# EAGLE design ChargeControllerMainBoard-v2 (EAGLE 9.2.2)
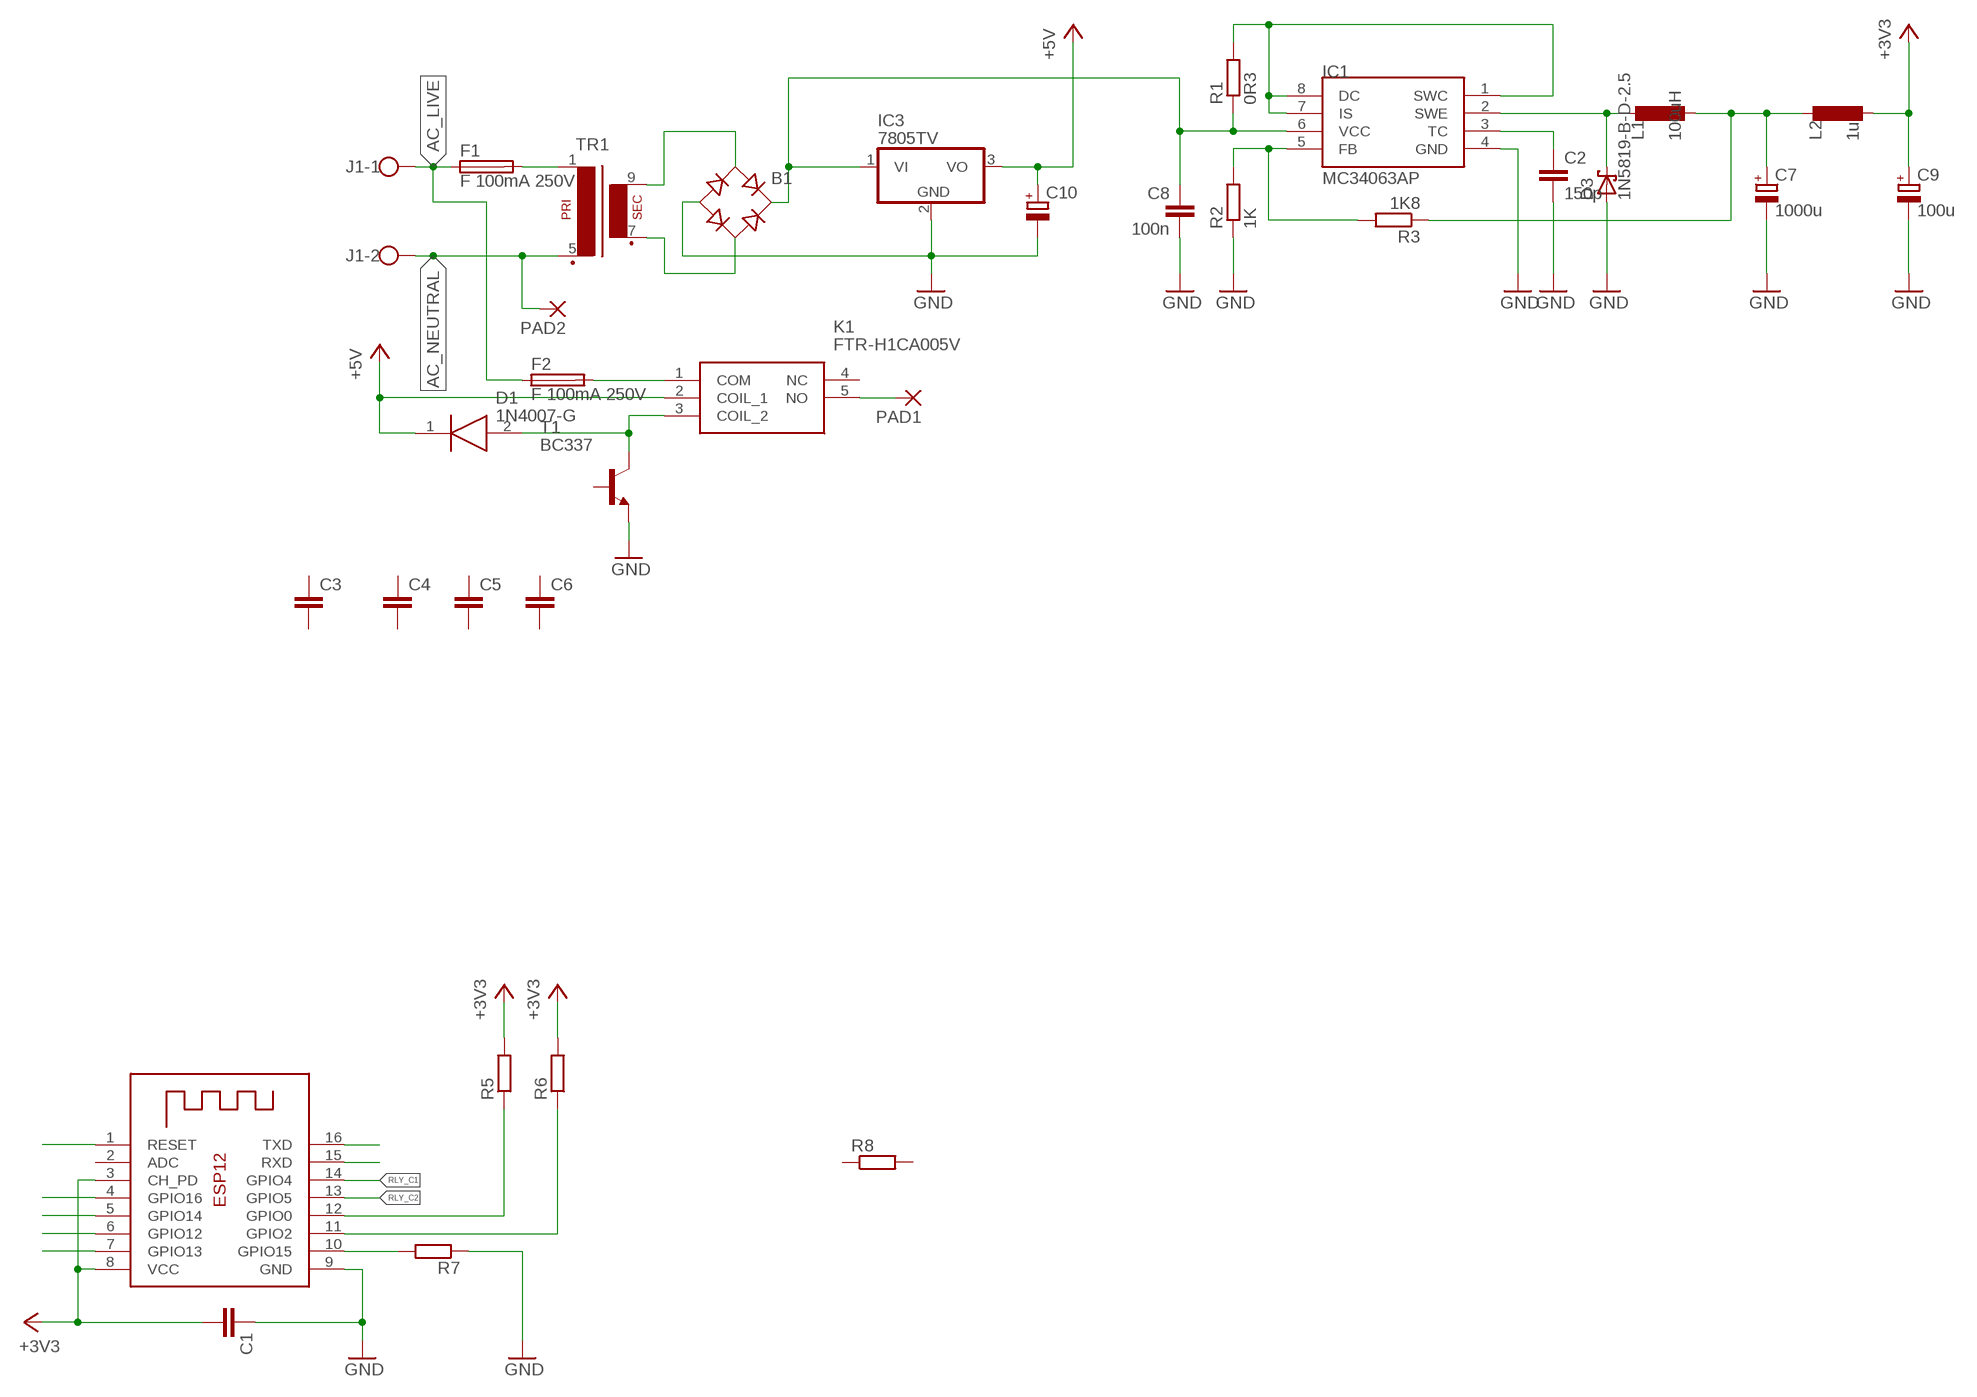
[diagram p0: schematic, sheet 1]

## Parts
B1  B-DIL  [B-DIL]
C1  C-EUC0805  [C0805]
C2  150p  C-EU025-024X044  [C025-024X044]
C3  C-EUC0805  [C0805]
C4  C-EUC0805  [C0805]
C5  C-EUC0805  [C0805]
C6  C-EUC0805  [C0805]
C7  1000u  CPOL-EUE3.5-8  [E3,5-8]
C8  100n  C-EU025-024X044  [C025-024X044]
C9  100u  CPOL-EUE3.5-8  [E3,5-8]
C10  CPOL-EUE3.5-8  [E3,5-8]
D1  1N4007-G  [DIOAD1410W90L470D235]
D3  1N5819-B-D-2.5  [D-2.5]
F1  F 100mA 250V  SH22,5  [SH22,5]
F2  F 100mA 250V  SH22,5  [SH22,5]
IC1  MC34063AP  [DIL08]
IC3  7805TV  [TO220V]
J1  W237-102  [W237-102]
K1  FTR-H1CA005V  [FTRH1CA005V]
L1  100uH  L-EU6000-XXX-RC  [6000-XXXX-RC]
L2  1u  L-EU0204V  [0204V]
PAD1  2,54/1,1  [2,54/1,1]
PAD2  2,54/1,1  [2,54/1,1]
R1  0R3  R-EU_0204/2V  [0204V]
R2  1K  R-EU_0204/2V  [0204V]
R3  1K8  R-EU_0204/2V  [0204V]
R5  R-EU_R0805  [R0805]
R6  R-EU_R0805  [R0805]
R7  R-EU_R0805  [R0805]
R8  R-EU_R0805  [R0805]
T1  BC337  [TO92]
TR1  EI30-1  [EI30-1]
X1  ESP-12  [ESP-12]

## Nets
+3V3: C1.2 C9.+ L2.2 R5.2 R6.2 X1.3(CH_PD) X1.8(VCC)
+5V: C10.+ D1.1(K) IC3.3(VO) K1.2(COIL_1)
AC_LIVE: F1.1 F2.1 J1.1
AC_NEUTRAL: J1.2 PAD2.1(P) TR1.5(P2)
GND: B1.- C1.1 C2.2 C7.- C8.2 C9.- C10.- D3.A IC1.4(GND) IC3.2(GND) R2.1 R7.1 T1.1(E) X1.9(GND)
N$1: IC1.1(SWC) IC1.7(IS) IC1.8(DC) R1.2
N$2: IC1.5(FB) R2.2 R3.2
N$3: C2.1 IC1.3(TC)
N$4: D3.C IC1.2(SWE) L1.1
N$5: B1.AC1 TR1.9(S4)
N$6: C7.+ L1.2 L2.1 R3.1
N$7: K1.5(NO) PAD1.1(P)
N$8: F2.2 K1.1(COM)
N$9: B1.AC2 TR1.7(S3)
N$10: D1.2(A) K1.3(COIL_2) T1.3(C)
N$11: R5.1 X1.12(GPIO0)
N$12: R6.1 X1.11(GPIO2)
N$13: R7.2 X1.10(GPIO15)
N$14: X1.7(GPIO13)
N$15: X1.6(GPIO12)
N$16: X1.5(GPIO14)
N$17: X1.4(GPIO16)
N$18: X1.1(RESET)
N$20: F1.2 TR1.1
N$21: X1.15(RXD)
N$22: X1.16(TXD)
N$25: B1.+ C8.1 IC1.6(VCC) IC3.1(VI) R1.1
RLY_C1: X1.14(GPIO4)
RLY_C2: X1.13(GPIO5)
Unconnected: C3.1 C3.2 C4.1 C4.2 C5.1 C5.2 C6.1 C6.2 K1.4(NC) R8.1 R8.2 T1.2(B) X1.2(ADC)

## Library data of the parts
B1 = rectifier:B-DIL: RECTIFIER
C1-C6 C8 = rcl:C-EU: CAPACITOR, European symbol; SPICEPREFIX: C
C7 C9 C10 = rcl:CPOL-EU: POLARIZED CAPACITOR, European symbol; SPICEPREFIX: C
D1 = SamacSys_Parts:1N4007-G: Rectifiers 1A 1000V Source: Datasheet <http://www.comchiptech.com/cms/UserFiles/QW-BG013 1N4001 Thru456224. 1N4007 REV.A.pdf>; ALLIED_NUMBER: 70426645; ALLIED_PRICE-STOCK: https://www.alliedelec.com/comchip-technology-1n4007-g/70426645/; DESCRIPTION: Rectifiers 1A 1000V; HEIGHT: mm; MANUFACTURER_NAME: Comchip Technology; MANUFACTURER_PART_NUMBER: 1N4007-G; MOUSER_PART_NUMBER: 750-1N4007-G; MOUSER_PRICE-STOCK: https://www.mouser.com/Search/Refine.aspx?Keyword=750-1N4007-G
D3 = _mod_diode:1N581*: 1.0A SCHOTTKY BARRIER RECTIFIER Source: http://www.diodes.com/datasheets/ds23001.pdf
F1 F2 = fuse:SH22,5: FUSE HOLDER grid 22,5 mm, OGN0031 8201, Schurter (Buerklin); MF: SCHURTER; MPN: 0031.8201; OC_FARNELL: 1162740; OC_NEWARK: 96F8317
IC1 = mc34063:MC34063
IC3 = linear:78*: Positive VOLTAGE REGULATOR Source: http://cache.national.com/ds/LM/LM78L05.pdf http://www.fairchildsemi.com/ds/LM/LM7805.pdf
J1 = con-wago-500:W237-102: WAGO SCREW CLAMP; MPN: 237-102; OC_FARNELL: unknown; OC_NEWARK: 70K9898
K1 = SamacSys_Parts:FTR-H1CA005V: General Purpose Relays Low Profile 10A 5VDC Source: Datasheet <https://www.fujitsu.com/downloads/MICRO/fcai/relays/ftr-h1.pdf>; DESCRIPTION: General Purpose Relays Low Profile 10A 5VDC; HEIGHT: 16mm; MANUFACTURER_NAME: FUJITSU; MANUFACTURER_PART_NUMBER: FTR-H1CA005V; MOUSER_PART_NUMBER: 817-FTR-H1CA005V; MOUSER_PRICE-STOCK: https://www.mouser.com/Search/Refine.aspx?Keyword=817-FTR-H1CA005V
L1 L2 = rcl:L-EU: INDUCTOR, European symbol; SPICEPREFIX: L
PAD1 PAD2 = wirepad:2,54/1,1: THROUGH-HOLE PAD
R1-R3 R5-R8 = rcl:R-EU_: RESISTOR, European symbol; SPICEPREFIX: R
T1 = transistor:BC337: NPN TRANSISTOR
TR1 = trafo:EI30-1: TRANSFORMER 1 primary winding, 1 secondary winding ERA
X1 = adafruit:ESP-12

## Board
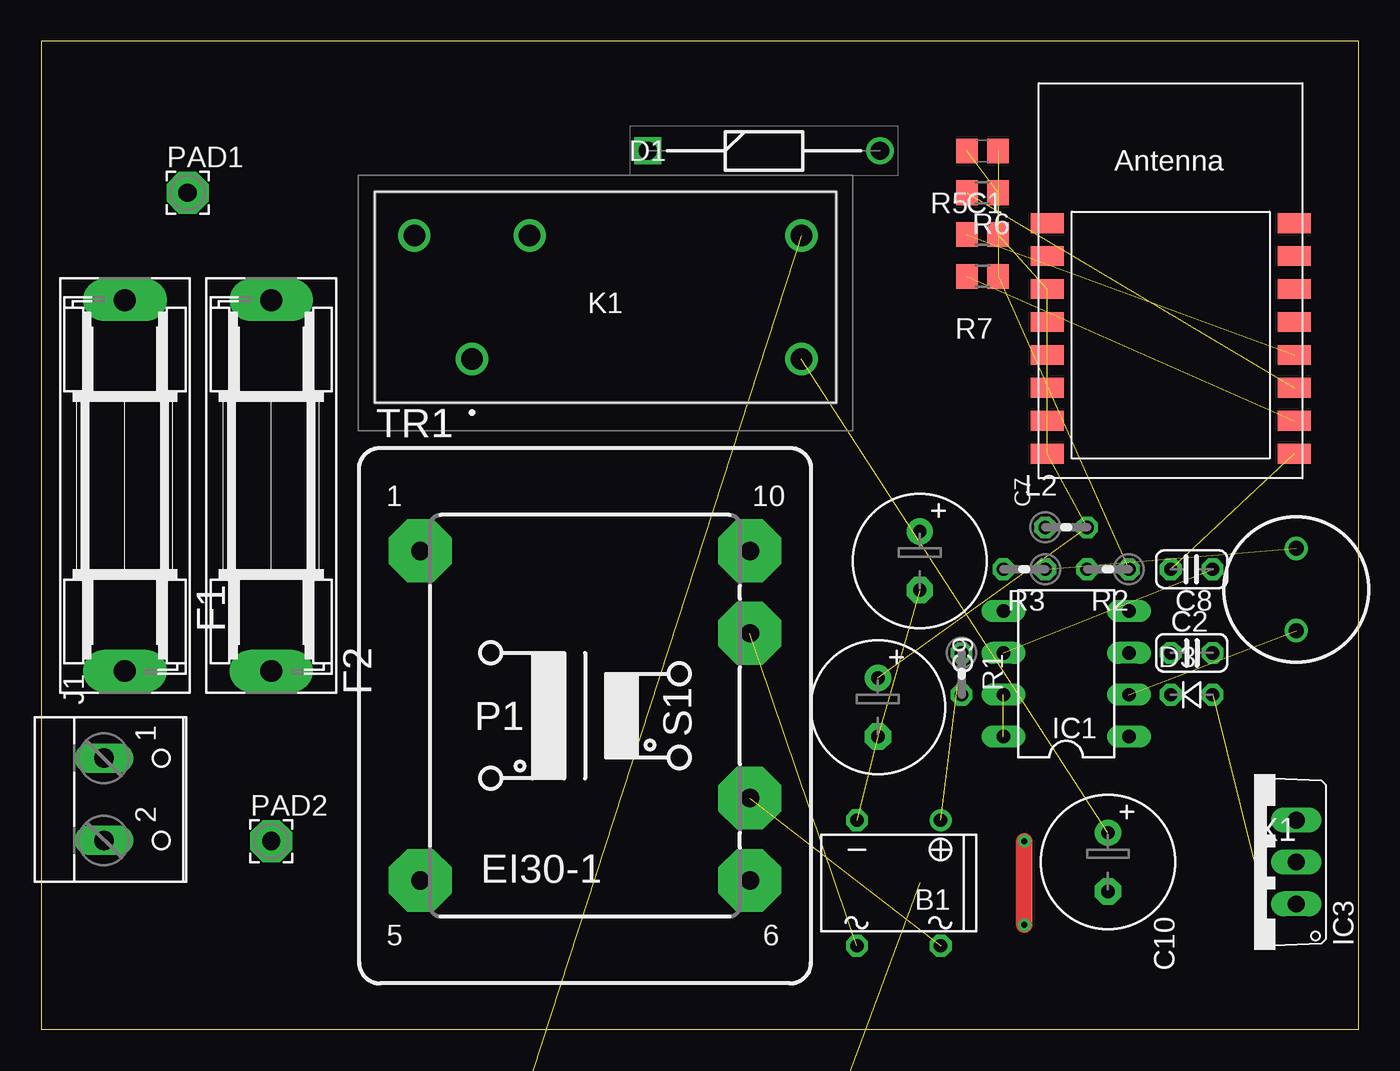
[diagram p1: board, top side]
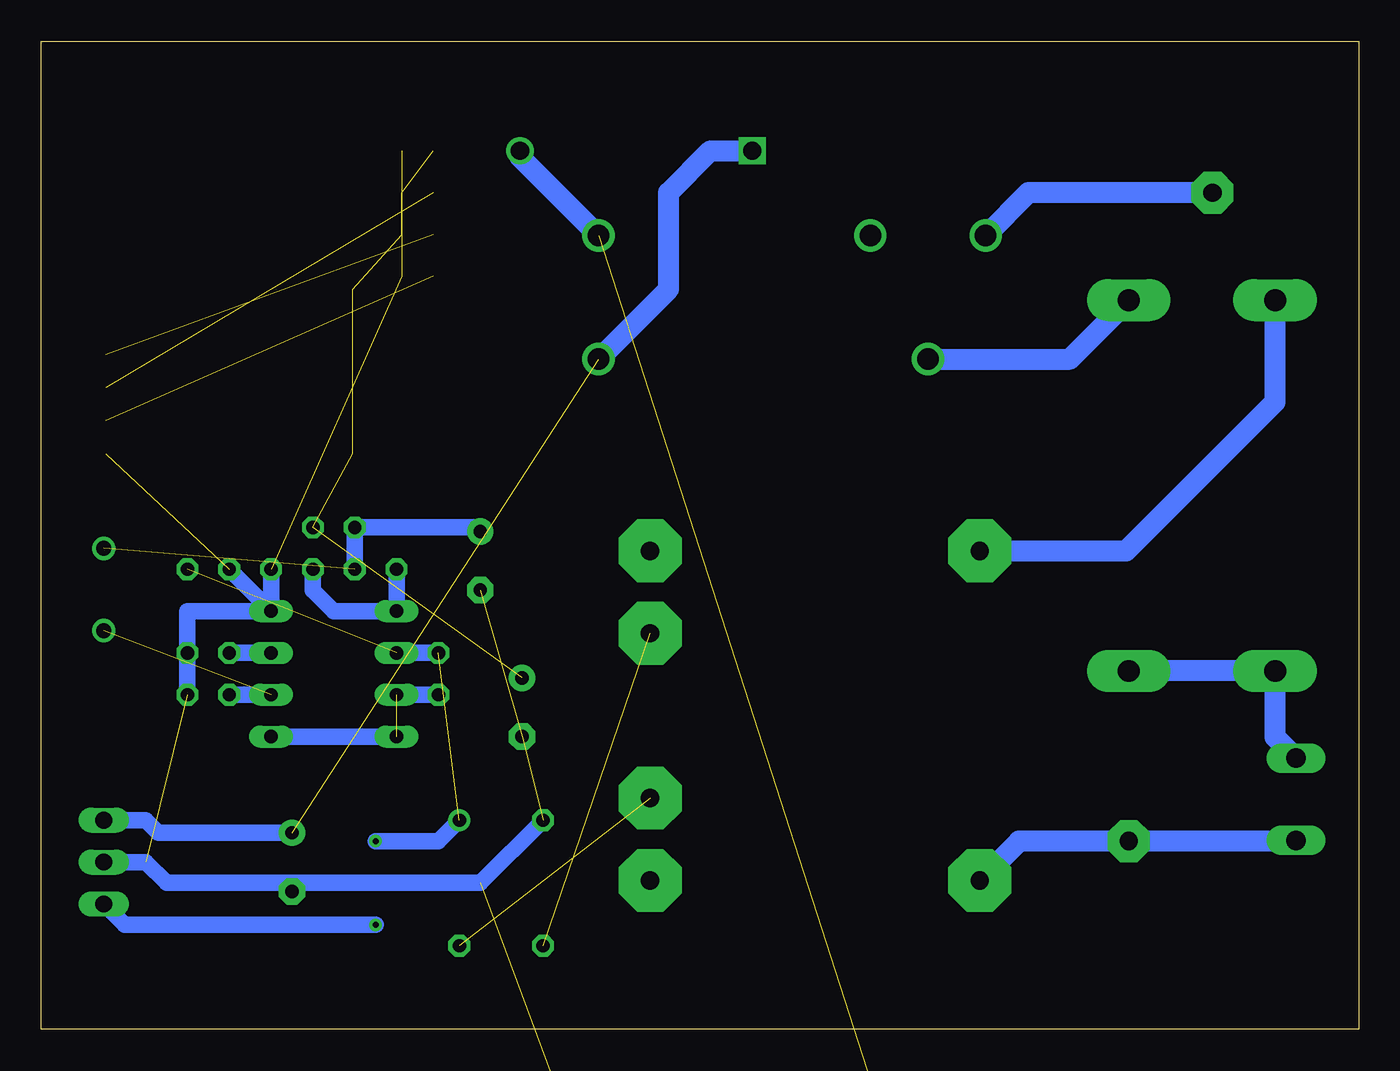
[diagram p2: board, bottom side, seen from below]

Size 80 x 60 mm. Coordinates in mm from the lower left corner, seen from the top.
Outline: 0,0 80,0 80,60 0,60 0,0
Copper layers (1*16): Top 0.035mm / dielectric 1.5mm / Bottom 0.035mm
Design rules "default": minimum track width 6mil, minimum drill 0.35mm, track to track 6mil, track to pad 6mil, pad to pad 6mil, via to via 6mil, smd to smd 6mil, copper to edge 40mil, drill to drill 6mil, minimum pad ring 10mil, minimum via ring 8mil, stop-mask expansion 4mil, vias tented up to drill 0mil, thermal gap 10mil

### Footprints (pad centres in the part's own frame; a part is rotated, then mirrored left to right if it is on the bottom)
B-DIL = drill 0.813: + -2.54,-3.81 | drill 0.813 octagon: - 2.54,-3.81; AC1 2.54,3.81; AC2 -2.54,3.81
C0805 = smd 1.3 x 1.5: 1 -0.95,0; 2 0.95,0
C025-024X044 = drill 0.813 octagon: 1 -1.27,0; 2 1.27,0
E3,5-8 = drill 0.813 pad 1.6: + -1.778,0 | drill 0.813 pad 1.6 octagon: - 1.778,0
DIOAD1410W90L470D235 = drill 1.1 pad 1.65 square: 1 0,0 | drill 1.1 pad 1.65: 2 14.1,0
D-2.5 = drill 0.813 octagon: A 1.27,0; C -1.27,0
SH22,5 = drill 1.321 pad 2.54 long: 1 -11.252,0; 2 11.252,0
DIL08 = drill 0.813 long: 1 -3.81,-3.81; 2 -1.27,-3.81; 3 1.27,-3.81; 4 3.81,-3.81; 5 3.81,3.81; 6 1.27,3.81; 7 -1.27,3.81; 8 -3.81,3.81
TO220V = drill 1.016 long: 1 -2.54,-2.54; 2 0,-2.54; 3 2.54,-2.54
W237-102 = drill 1.194 long: 1 -2.5,-1.27; 2 2.5,-1.27
FTRH1CA005V = drill 1.3 pad 1.95: 1 22.1,3.75; 2 2.1,3.75; 3 2.1,-3.75; 4 18.6,-3.75; 5 25.6,-3.75
6000-XXXX-RC = drill 0.9 pad 1.422: 1 -2.5,0; 2 2.5,0
0204V = drill 0.813 octagon: 1 -1.27,0; 2 1.27,0
2,54/1,1 = drill 1.118 pad 2.54 octagon: 1 0,0
R0805 = smd 1.3 x 1.5: 1 -0.95,0; 2 0.95,0
TO92 = drill 0.813 octagon: 1 1.27,0; 2 0,1.905; 3 -1.27,0
EI30-1 = drill 1.118 pad 3.81 octagon: 1 -10.008,10.008; 5 -10.008,-10.008; 6 10.008,-10.008; 7 10.008,-5.004; 9 10.008,5.004; 10 10.008,10.008
ESP-12 = smd 2 x 1.2: 1 -7.5,4.5; 2 -7.5,2.5; 3 -7.5,0.5; 4 -7.5,-1.5; 5 -7.5,-3.5; 6 -7.5,-5.5; 7 -7.5,-7.5; 8 -7.5,-9.5; 9 7.5,-9.5; 10 7.5,-7.5; 11 7.5,-5.5; 12 7.5,-3.5; 13 7.5,-1.5; 14 7.5,0.5; 15 7.5,2.5; 16 7.5,4.5

### Placement (x,y rotation side)
B1  52.07,8.89 180 top
C1  57.15,53.34 180 top
C2  69.85,22.86 0 top
C3  -52.07,-95.25 0 top  (outside the outline)
C4  -52.07,-100.33 0 top  (outside the outline)
C5  -52.07,-105.41 0 top  (outside the outline)
C6  -52.07,-110.49 0 top  (outside the outline)
C7  53.34,28.45 270 top
C8  69.85,27.94 180 top
C9  50.8,19.56 270 top
C10  64.77,10.16 270 top
D1  36.83,53.34 0 top
D3  69.85,20.32 0 top
F1  5.08,33.02 90 top
F2  13.97,33.02 90 top
IC1  62.23,21.59 90 top
IC3  73.66,10.16 90 top
J1  5.08,13.97 270 top
K1  48.26,44.45 180 top
L1  76.2,26.71 90 top
L2  62.23,30.48 0 top
PAD1  8.89,50.8 0 top
PAD2  13.97,11.43 0 top
R1  55.88,21.59 270 top
R2  64.77,27.94 180 top
R3  59.69,27.94 180 top
R5  57.15,48.26 0 top
R6  57.15,50.8 0 top
R7  57.15,45.72 180 top
R8  -44.45,-43.18 0 top  (outside the outline)
T1  -78.74,-344.17 0 top  (outside the outline)
TR1  33.02,19.05 0 top
X1  68.58,44.45 0 top

### Tracks (layer width: path | path; a pad name or v marks a point on that pad's centre or on a via)
+3V3  (6 unrouted)
+5V  (1 unrouted)
  Bottom 1.016: C10.+ 72.9,11.94 73.66,12.7 IC3.3
  Bottom 1.27: K1.2 41.91,44.95 41.91,50.8 39.37,53.34 D1.1
AC_LIVE
  Bottom 1.27: J1.1 5.08,17.74 F1.1 F2.1
AC_NEUTRAL
  Bottom 1.27: J1.2 3.85,11.43 PAD2.1 20.62,11.43 TR1.5
GND  (7 unrouted)
  Bottom 1.016: B1.- 53.34,8.89 64.77,8.89 | IC3.2 73.66,10.16 72.39,8.89 64.77,8.89 | C10.- 64.77,8.89 | IC1.4 71.12,25.4 C2.2 D3.A | R2.1 IC1.4 | C8.2 IC1.4
N$1  (1 unrouted)
  Bottom 1.016: R1.2 IC1.7 | IC1.8 IC1.1
N$2
  Bottom 1.016: R2.2 63.5,26.67 62.23,25.4 IC1.5 R3.2
N$3
  Bottom 1.016: C2.1 IC1.3
N$4  (1 unrouted)
  Bottom 1.016: D3.C IC1.2
N$5  (1 unrouted)
N$6  (1 unrouted)
  Bottom 1.016: R3.1 L2.1 53.59,30.48 C7.+
N$7
  Bottom 1.27: PAD1.1 20.06,50.8 K1.5
N$8
  Bottom 1.27: K1.1 17.54,40.7 F2.2
N$9  (1 unrouted)
N$10  (1 unrouted)
  Bottom 1.27: K1.3 50.93,52.97 D1.2
N$11  (1 unrouted)
N$12  (1 unrouted)
N$13  (1 unrouted)
N$20
  Bottom 1.27: TR1.1 14.12,29.06 5.08,38.1 F1.2
N$25  (via drill 0.35)  (2 unrouted)
  Top 1.016: v59.69,11.43 v59.69,6.35
  Bottom 1.016: B1.+ 55.88,11.43 v59.69,11.43 | v59.69,6.35 74.93,6.35 IC3.1 | R1.1 IC1.6

### Text on the board
tNames: X1